# Altium schematic sheet EndEffector- Power.SchDoc
size A
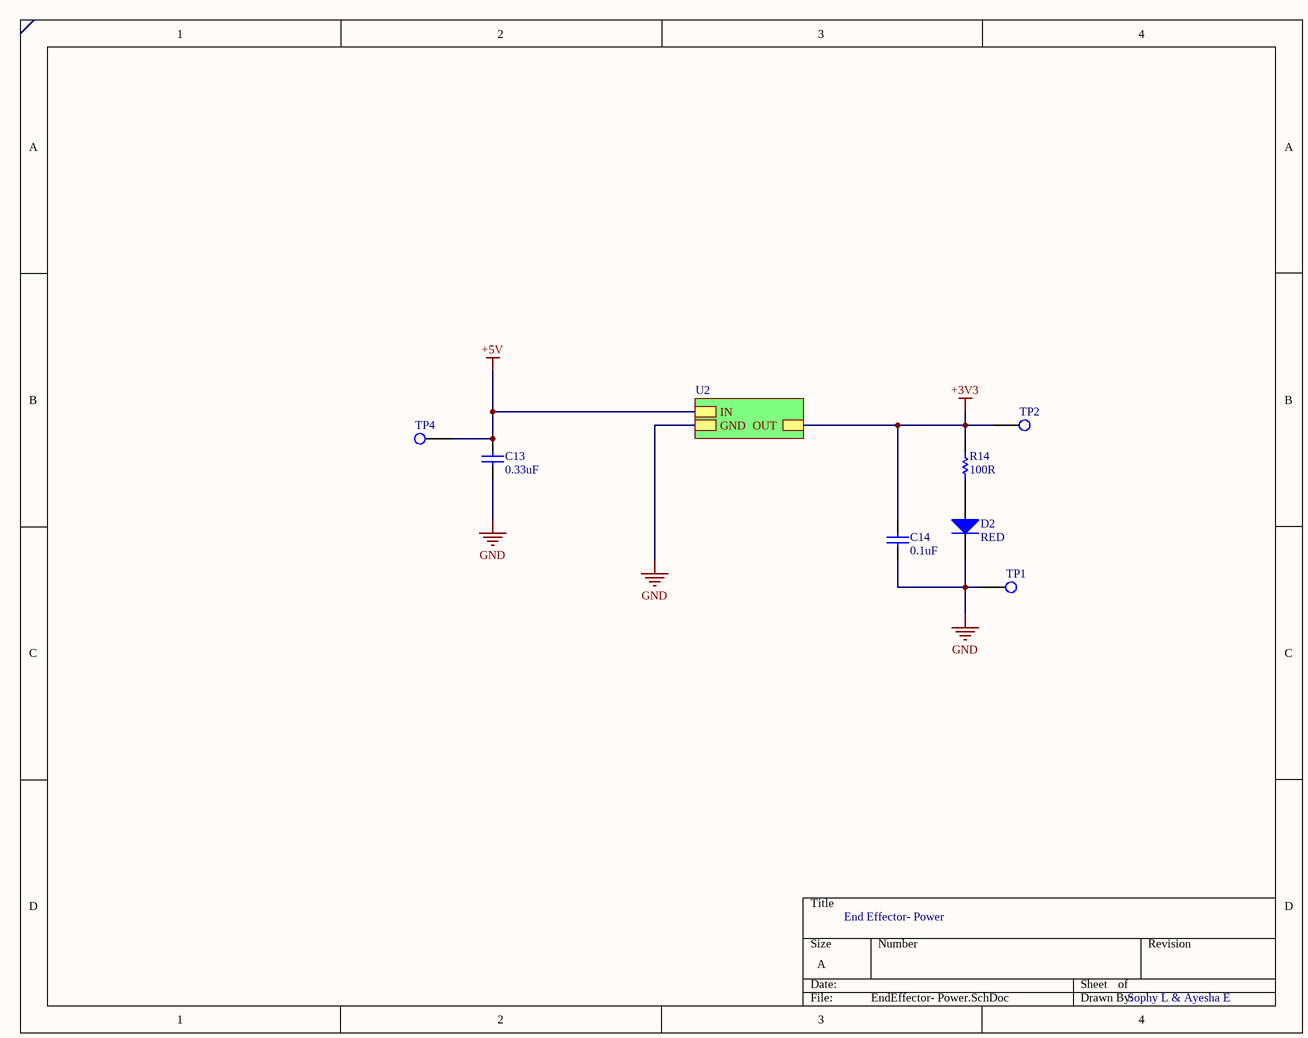
[diagram p0: EndEffector- Power.SchDoc]

## Parts
C13  value 0.33uF  [CAPC0603(1608)55_N]  (hidden comment: CAP_0.1uF_16V_0603)
C14  value 0.1uF  [CAPC0603(1608)55_N]  (hidden comment: CAP_0.1uF_16V_0603)
D2  RED  [LED-1]
R14  value 100R  [RESC0201(0603)_N]  (hidden comment: RES_120R_0603)
TP1  (no value)  [TESTPOINT_LOOP]
TP2  (no value)  [TESTPOINT_LOOP]
TP4  (no value)  [TESTPOINT_LOOP]

## Sub-sheets
U2 = U2: IN, GND, OUT

## Nets
+3V3: C14.2 R14.2 TP2.1(=value) ; sheet U2/OUT
+5V: C13.2 TP4.1(=value) ; sheet U2/IN
GND: C13.1 C14.1 D2.2(K) TP1.1(=value) ; sheet U2/GND
NetD2_1: D2.1(A) R14.1

## Notes on the sheet
- End Effector- Power
- Sophy L & Ayesha E

## Library data of the parts
C13 C14 = CAP_0.1uF_16V_0603: CAP CER 0.1UF 16V X7R 0603; Part Number: CC0603KRX7R7BB104; Manufacturer: Yageo; Dimensions: 0.063" L x 0.031" W (1.60mm x 0.80mm); Package: 0603 (1608 Metric); Temperature Coefficient: X7R; Voltage Rating: 16V
D2 = DIO_BAS16GW: ESD PROTECTION DIODE; Manufacturer: Nexperia; Package: SOD-123; Part Number: BAS16GW; ComponentLink1Description: Datasheet; ComponentLink1URL: https://assets.nexperia.com/documents/data-sheet/BAS16GW.pdf
R14 = RES_120R_0603: RES SMD 120 OHM 5% 1/10W 0603; Manufacturer: Yageo; Part Number (MPN): RC0603JR-07120RL; Package: 0603 (1608 Metric); Dimensions: 0.063" L x 0.031" W (1.60mm x 0.80mm); Tolerance: 5%
TP1 TP2 TP4 = TESTPOINT_LOOP